# EAGLE design transistor_as_amplifier (EAGLE 9.6.2)
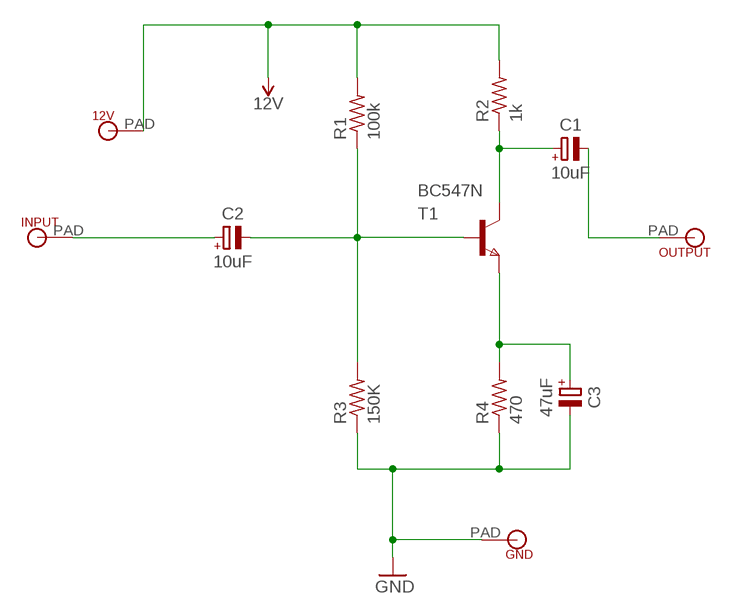
[diagram p0: schematic, sheet 1]

## Parts
12V  MICROBIT_PAD  [MICROBIT_PAD]
C1  10uF  CAPACITOR_POL-E2-4  [C_E2-4]
C2  10uF  CAPACITOR_POL-E2-4  [C_E2-4]
C3  47uF  CAPACITOR_POL-E2-4  [C_E2-4]
GND  MICROBIT_PAD  [MICROBIT_PAD]
INPUT  MICROBIT_PAD  [MICROBIT_PAD]
OUTPUT  MICROBIT_PAD  [MICROBIT_PAD]
R1  100k  R-US_0207/12  [0207/12]
R2  1k  R-US_0207/12  [0207/12]
R3  150K  R-US_0207/12  [0207/12]
R4  470  R-US_0207/12  [0207/12]
T1  BC547N  [TO92]

## Nets
12V: 12V.PAD R1.2 R2.2
GND: C3.- GND.PAD R3.1 R4.1
N$1: C3.+ R4.2 T1.3(E)
N$2: C1.+ R2.1 T1.1(C)
N$3: C2.- R1.1 R3.2 T1.2(B)
N$4: C1.- OUTPUT.PAD
N$7: C2.+ INPUT.PAD

## Library data of the parts
12V GND INPUT OUTPUT = microbit:MICROBIT_PAD
C1-C3 = we-rcl:CAPACITOR_POL: Capacitor (Polarized)
R1-R4 = rcl:R-US_: RESISTOR, American symbol; SPICEPREFIX: R
T1 = BC547:BC547: Check availability <https://pricing.snapeda.com/parts/BC547/ON%20Semiconductor/view-part?ref=eda>; AVAILABILITY: In Stock; CHECK_PRICES: https://www.snapeda.com/parts/BC547/Onsemi/view-part/?ref=eda; DESCRIPTION: Trans GP BJT NPN 45V 0.1A 500mW 3-Pin TO-92 T/R; MF: ON Semiconductor; MP: BC547; PACKAGE: None; PRICE: None; PURCHASE-URL: https://www.snapeda.com/api/url_track_click_mouser/?unipart_id=11254981&manufacturer=ON Semiconductor&part_name=BC547&search_term=None; SNAPEDA_LINK: https://www.snapeda.com/parts/BC547/Onsemi/view-part/?ref=snap

## Board
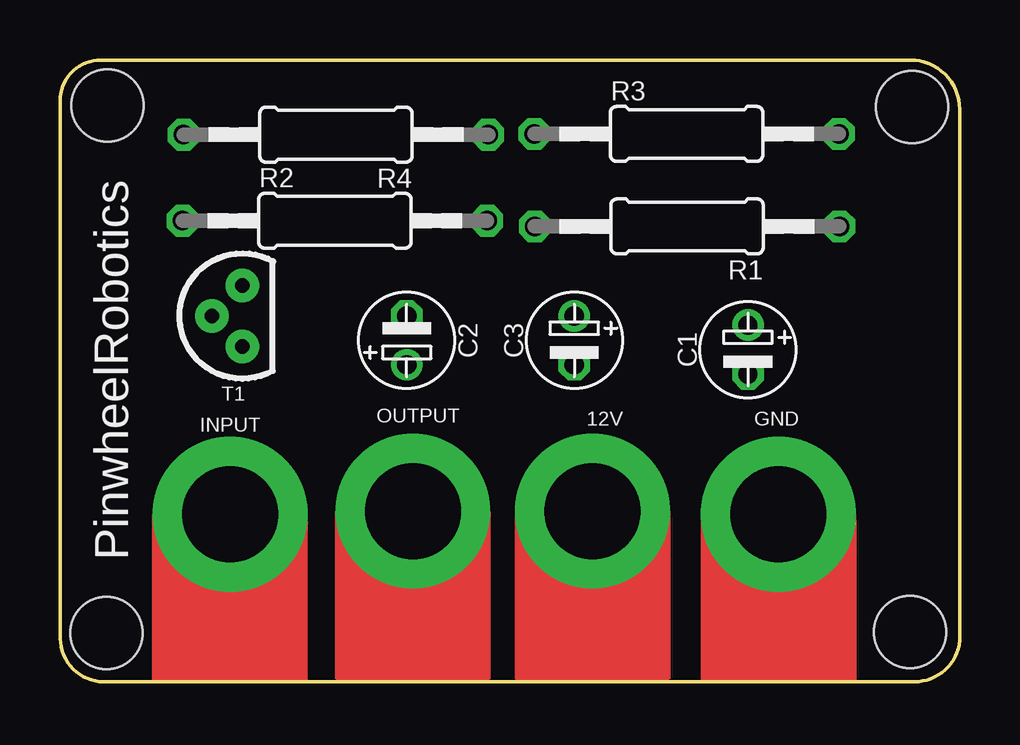
[diagram p1: board, top side]
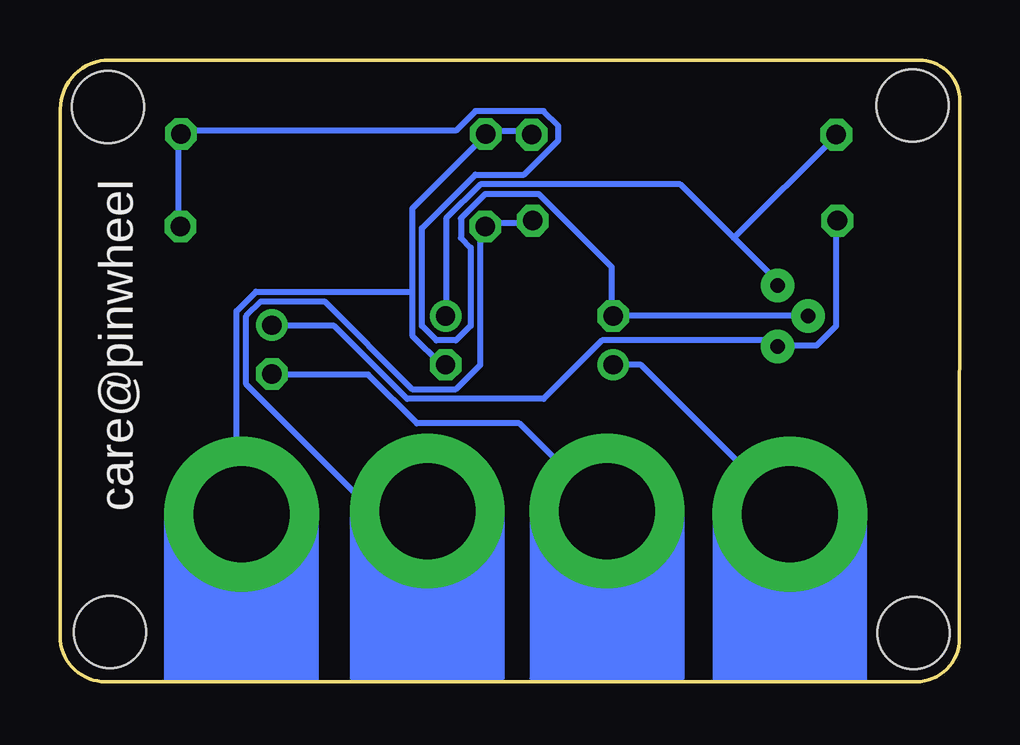
[diagram p2: board, bottom side, seen from below]

Size 37.52 x 25.91 mm. Coordinates in mm from the lower left corner, seen from the top.
Outline: 0,24.2 0.02,1.8 arc90 1.82,0 35.62,0 arc90 37.52,1.9 37.5,23.86 arc90 35.45,25.91 1.71,25.91 arc90 0,24.2
Copper layers (1*16): Top 0.035mm / dielectric 1.5mm / Bottom 0.035mm
Design rules "default *": minimum track width 10mil, minimum drill 0.35mm, track to track 6mil, track to pad 6mil, pad to pad 6mil, via to via 6mil, smd to smd 6mil, copper to edge 40mil, drill to drill 6mil, minimum pad ring 10mil, minimum via ring 8mil, stop-mask expansion 4mil, vias tented up to drill 0mil, thermal gap 10mil
Holes 3 mm at 1.97,24 1.93,2.04 35.44,2.07 35.52,23.94

### Footprints (pad centres in the part's own frame; a part is rotated, then mirrored left to right if it is on the bottom)
MICROBIT_PAD = drill 4 pad 6.452: PAD 0,0
C_E2-4 = drill 0.8 pad 1.3: + 0,1.016 | drill 0.8 pad 1.3 octagon: - 0,-1.016
0207/12 = drill 0.813 octagon: 1 -6.35,0; 2 6.35,0
TO92 = drill 0.61 pad 1.397: 1 0,0; 2 1.27,1.27; 3 2.54,0

### Placement (x,y rotation side)
12V  22.2,7.11 0 top
C1  28.68,13.84 0 top
C2  14.46,14.22 180 top
C3  21.44,14.22 0 top
GND  29.95,6.99 0 top
INPUT  7.09,6.99 0 top
OUTPUT  14.71,7.11 0 top
R1  26.14,18.97 180 top
R2  11.46,19.21 0 top
R3  26.12,22.83 0 top
R4  11.51,22.79 180 top
T1  7.6,13.97 90 top

### Tracks (layer width: path | path; a pad name or v marks a point on that pad's centre or on a via)
12V
  Bottom 0.254: R2.2 17.96,19.1 19.79,19.1 R1.2 19.99,18.9 19.99,13.21 21.01,12.19 22.84,12.19 26.5,15.85 29.14,15.85 29.75,15.24 29.75,12.39 24.46,7.11 12V.PAD
GND
  Bottom 0.254: 22.84,16.26 22.84,19.71 19.79,22.76 R3.1 19.59,22.96 17.96,22.96 R4.1 | 22.84,16.26 22.84,14.43 21.62,13.21 C3.- | 22.84,16.26 29.34,16.26 30.15,15.44 30.15,7.32 29.95,7.11 GND.PAD
N$1
  Bottom 0.254: 9.43,18.49 7.6,16.66 T1.3 | 9.43,18.49 11.66,20.73 19.99,20.73 21.42,19.3 21.42,15.24 C3.+ | 9.43,18.49 5.16,22.76 R4.2
N$2
  Bottom 0.254: 7.6,14.02 7.8,14.22 14.91,14.22 17.35,11.79 23.04,11.79 26.09,14.83 28.53,14.83 C1.+ | 7.6,14.02 5.97,14.02 5.16,14.83 5.16,19.1 R2.1 | 7.6,14.02 T1.1
N$3
  Bottom 0.254: R1.1 32.59,19.1 32.59,22.76 R3.2 32.39,22.96 21.01,22.96 20.2,23.77 17.35,23.77 16.74,23.16 16.74,22.55 18.16,21.13 20.2,21.13 22.43,18.9 22.43,14.83 21.82,14.22 21.01,14.22 20.4,14.83 20.4,18.09 20.81,18.49 20.81,19.3 19.79,20.32 17.56,20.32 14.51,17.27 14.51,15.24 C2.- T1.2
N$4
  Bottom 0.254: OUTPUT.PAD 18.37,10.77 22.64,10.77 24.67,12.8 28.53,12.8 C1.-
N$7
  Bottom 0.254: C2.+ 13.29,13.21 7.19,7.11 INPUT.PAD

### Text on the board
tPlace: PinwheelRobotics
bPlace: care@pinwheel